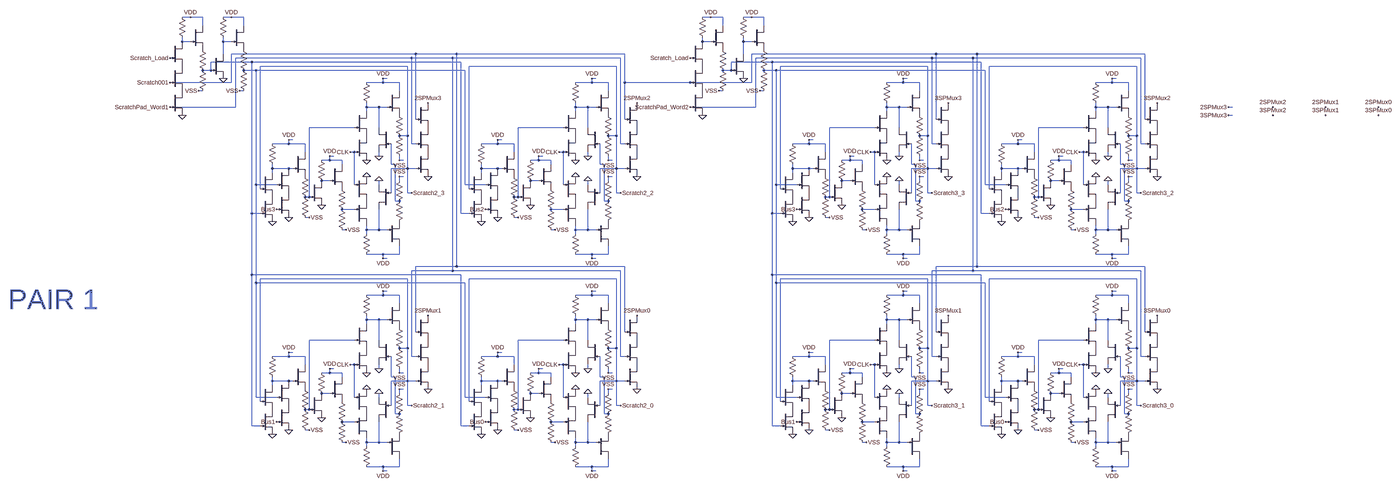
[diagram p0: schematic Pair 2.asc, whole sheet]
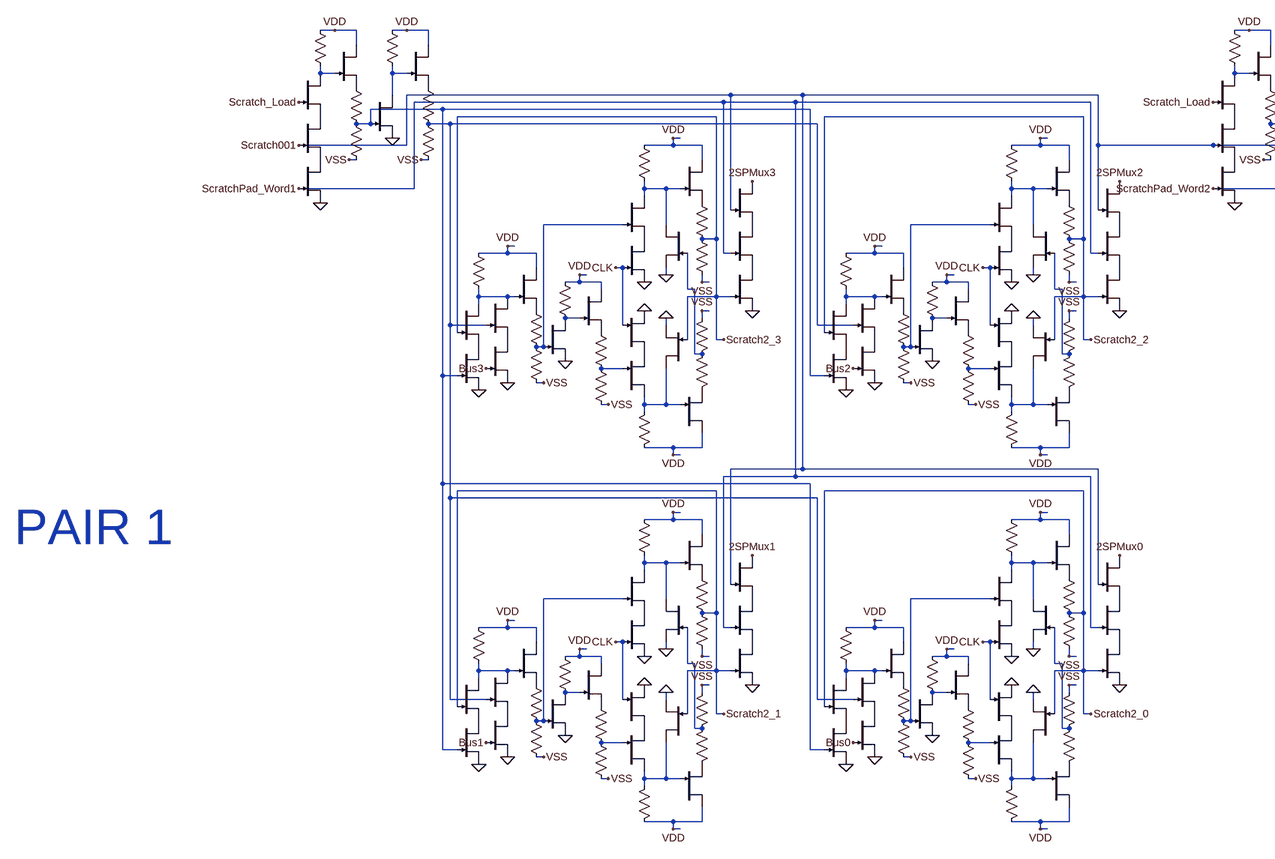
[diagram p1: schematic Pair 2.asc, part, row 1 of 1, column 1 of 2]
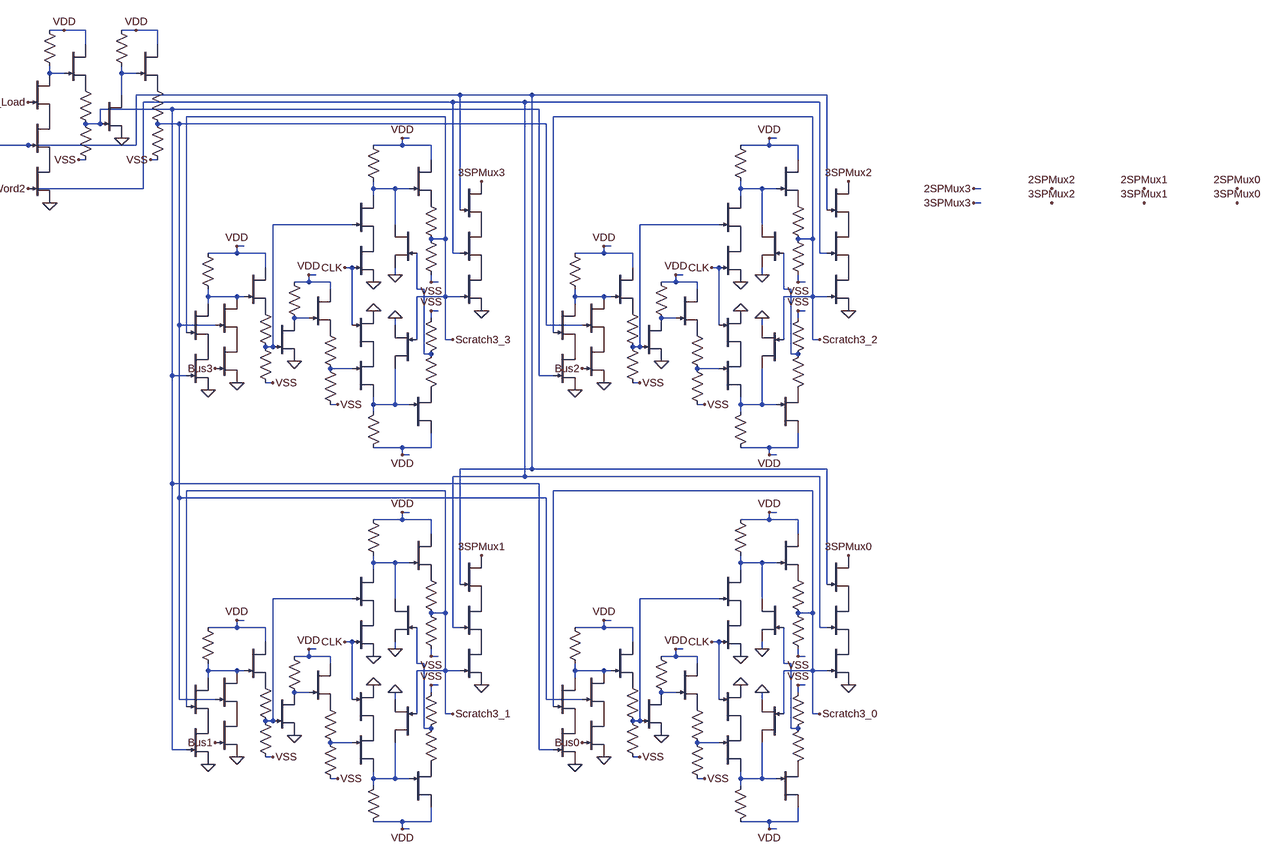
[diagram p2: schematic Pair 2.asc, part, row 1 of 1, column 2 of 2]
* Pair 2.asc
J0 N009 N013 P001 DR
R0 VDD N009 100k
J1 VDD N009 P002 DR
R1 P002 Scratch2_3 1k
R2 Scratch2_3 VSS 4.8k
J2 N009 N017 0 DR
J3 N033 N029 P003 DR
R3 VDD N033 100k
J4 VDD N033 P004 DR
R4 P004 N017 1k
R5 N017 VSS 4.8k
J5 N033 Scratch2_3 0 DR
J6 P001 CLK 0 DR
J7 P003 CLK 0 DR
J8 N021 Scratch2_3 P005 DR
R6 VDD N021 100k
J9 VDD N021 P006 DR
R7 P006 N013 1k
R8 N013 VSS 4.8k
J10 N021 N007 P007 DR
J11 N025 N013 0 DR
R9 VDD N025 50k
J12 VDD N025 P008 DR
R10 P008 N029 1k
R11 N029 VSS 4.5k
J13 P005 N005 0 DR
J14 P007 Bus3 0 DR
J15 P009 Scratch2_3 0 DR
J16 P010 ScratchPad_Word1 P009 DR
J17 2SPMux3 Scratch001 P010 DR
J18 N010 N014 P011 DR
R12 VDD N010 100k
J19 VDD N010 P012 DR
R13 P012 Scratch2_2 1k
R14 Scratch2_2 VSS 4.8k
J20 N010 N018 0 DR
J21 N034 N030 P013 DR
R15 VDD N034 100k
J22 VDD N034 P014 DR
R16 P014 N018 1k
R17 N018 VSS 4.8k
J23 N034 Scratch2_2 0 DR
J24 P011 CLK 0 DR
J25 P013 CLK 0 DR
J26 N022 Scratch2_2 P015 DR
R18 VDD N022 100k
J27 VDD N022 P016 DR
R19 P016 N014 1k
R20 N014 VSS 4.8k
J28 N022 N007 P017 DR
J29 N026 N014 0 DR
R21 VDD N026 50k
J30 VDD N026 P018 DR
R22 P018 N030 1k
R23 N030 VSS 4.5k
J31 P015 N005 0 DR
J32 P017 Bus2 0 DR
J33 P019 Scratch2_2 0 DR
J34 P020 ScratchPad_Word1 P019 DR
J35 2SPMux2 Scratch001 P020 DR
R24 VDD N001 100k
J36 VDD N001 P021 DR
R25 P021 N005 1k
R26 N005 VSS 4.8k
J37 N002 N005 0 DR
R27 VDD N002 50k
J38 VDD N002 P022 DR
R28 P022 N007 1k
R29 VSS N007 4.5k
J39 N001 Scratch_Load P023 DR
J40 P023 Scratch001 P024 DR
J41 P024 ScratchPad_Word1 0 DR
J42 N037 N041 P025 DR
R30 VDD N037 100k
J43 VDD N037 P026 DR
R31 P026 Scratch2_1 1k
R32 Scratch2_1 VSS 4.8k
J44 N037 N045 0 DR
J45 N061 N057 P027 DR
R33 VDD N061 100k
J46 VDD N061 P028 DR
R34 P028 N045 1k
R35 N045 VSS 4.8k
J47 N061 Scratch2_1 0 DR
J48 P025 CLK 0 DR
J49 P027 CLK 0 DR
J50 N049 Scratch2_1 P029 DR
R36 VDD N049 100k
J51 VDD N049 P030 DR
R37 P030 N041 1k
R38 N041 VSS 4.8k
J52 N049 N007 P031 DR
J53 N053 N041 0 DR
R39 VDD N053 50k
J54 VDD N053 P032 DR
R40 P032 N057 1k
R41 N057 VSS 4.5k
J55 P029 N005 0 DR
J56 P031 Bus1 0 DR
J57 P033 Scratch2_1 0 DR
J58 P034 ScratchPad_Word1 P033 DR
J59 2SPMux1 Scratch001 P034 DR
J60 N038 N042 P035 DR
R42 VDD N038 100k
J61 VDD N038 P036 DR
R43 P036 Scratch2_0 1k
R44 Scratch2_0 VSS 4.8k
J62 N038 N046 0 DR
J63 N062 N058 P037 DR
R45 VDD N062 100k
J64 VDD N062 P038 DR
R46 P038 N046 1k
R47 N046 VSS 4.8k
J65 N062 Scratch2_0 0 DR
J66 P035 CLK 0 DR
J67 P037 CLK 0 DR
J68 N050 Scratch2_0 P039 DR
R48 VDD N050 100k
J69 VDD N050 P040 DR
R49 P040 N042 1k
R50 N042 VSS 4.8k
J70 N050 N007 P041 DR
J71 N054 N042 0 DR
R51 VDD N054 50k
J72 VDD N054 P042 DR
R52 P042 N058 1k
R53 N058 VSS 4.5k
J73 P039 N005 0 DR
J74 P041 Bus0 0 DR
J75 P043 Scratch2_0 0 DR
J76 P044 ScratchPad_Word1 P043 DR
J77 2SPMux0 Scratch001 P044 DR
J78 N011 N015 P045 DR
R54 VDD N011 100k
J79 VDD N011 P046 DR
R55 P046 Scratch3_3 1k
R56 Scratch3_3 VSS 4.8k
J80 N011 N019 0 DR
J81 N035 N031 P047 DR
R57 VDD N035 100k
J82 VDD N035 P048 DR
R58 P048 N019 1k
R59 N019 VSS 4.8k
J83 N035 Scratch3_3 0 DR
J84 P045 CLK 0 DR
J85 P047 CLK 0 DR
J86 N023 Scratch3_3 P049 DR
R60 VDD N023 100k
J87 VDD N023 P050 DR
R61 P050 N015 1k
R62 N015 VSS 4.8k
J88 N023 N008 P051 DR
J89 N027 N015 0 DR
R63 VDD N027 50k
J90 VDD N027 P052 DR
R64 P052 N031 1k
R65 N031 VSS 4.5k
J91 P049 N006 0 DR
J92 P051 Bus3 0 DR
J93 P053 Scratch3_3 0 DR
J94 P054 ScratchPad_Word2 P053 DR
J95 3SPMux3 Scratch001 P054 DR
J96 N012 N016 P055 DR
R66 VDD N012 100k
J97 VDD N012 P056 DR
R67 P056 Scratch3_2 1k
R68 Scratch3_2 VSS 4.8k
J98 N012 N020 0 DR
J99 N036 N032 P057 DR
R69 VDD N036 100k
J100 VDD N036 P058 DR
R70 P058 N020 1k
R71 N020 VSS 4.8k
J101 N036 Scratch3_2 0 DR
J102 P055 CLK 0 DR
J103 P057 CLK 0 DR
J104 N024 Scratch3_2 P059 DR
R72 VDD N024 100k
J105 VDD N024 P060 DR
R73 P060 N016 1k
R74 N016 VSS 4.8k
J106 N024 N008 P061 DR
J107 N028 N016 0 DR
R75 VDD N028 50k
J108 VDD N028 P062 DR
R76 P062 N032 1k
R77 N032 VSS 4.5k
J109 P059 N006 0 DR
J110 P061 Bus2 0 DR
J111 P063 Scratch3_2 0 DR
J112 P064 ScratchPad_Word2 P063 DR
J113 3SPMux2 Scratch001 P064 DR
R78 VDD N003 100k
J114 VDD N003 P065 DR
R79 P065 N006 1k
R80 N006 VSS 4.8k
J115 N004 N006 0 DR
R81 VDD N004 50k
J116 VDD N004 P066 DR
R82 P066 N008 1k
R83 VSS N008 4.5k
J117 N003 Scratch_Load P067 DR
J118 P067 Scratch001 P068 DR
J119 P068 ScratchPad_Word2 0 DR
J120 N039 N043 P069 DR
R84 VDD N039 100k
J121 VDD N039 P070 DR
R85 P070 Scratch3_1 1k
R86 Scratch3_1 VSS 4.8k
J122 N039 N047 0 DR
J123 N063 N059 P071 DR
R87 VDD N063 100k
J124 VDD N063 P072 DR
R88 P072 N047 1k
R89 N047 VSS 4.8k
J125 N063 Scratch3_1 0 DR
J126 P069 CLK 0 DR
J127 P071 CLK 0 DR
J128 N051 Scratch3_1 P073 DR
R90 VDD N051 100k
J129 VDD N051 P074 DR
R91 P074 N043 1k
R92 N043 VSS 4.8k
J130 N051 N008 P075 DR
J131 N055 N043 0 DR
R93 VDD N055 50k
J132 VDD N055 P076 DR
R94 P076 N059 1k
R95 N059 VSS 4.5k
J133 P073 N006 0 DR
J134 P075 Bus1 0 DR
J135 P077 Scratch3_1 0 DR
J136 P078 ScratchPad_Word2 P077 DR
J137 3SPMux1 Scratch001 P078 DR
J138 N040 N044 P079 DR
R96 VDD N040 100k
J139 VDD N040 P080 DR
R97 P080 Scratch3_0 1k
R98 Scratch3_0 VSS 4.8k
J140 N040 N048 0 DR
J141 N064 N060 P081 DR
R99 VDD N064 100k
J142 VDD N064 P082 DR
R100 P082 N048 1k
R101 N048 VSS 4.8k
J143 N064 Scratch3_0 0 DR
J144 P079 CLK 0 DR
J145 P081 CLK 0 DR
J146 N052 Scratch3_0 P083 DR
R102 VDD N052 100k
J147 VDD N052 P084 DR
R103 P084 N044 1k
R104 N044 VSS 4.8k
J148 N052 N008 P085 DR
J149 N056 N044 0 DR
R105 VDD N056 50k
J150 VDD N056 P086 DR
R106 P086 N060 1k
R107 N060 VSS 4.5k
J151 P083 N006 0 DR
J152 P085 Bus0 0 DR
J153 P087 Scratch3_0 0 DR
J154 P088 ScratchPad_Word2 P087 DR
J155 3SPMux0 Scratch001 P088 DR
.model NJF NJF
.model PJF PJF
.lib standard.jft
* PAIR 1
.backanno
.end